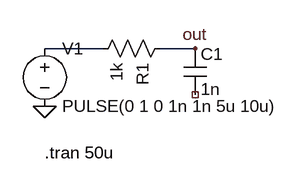
[diagram p0: schematic rc.asc]
rc.asc, the LTspice schematic file:
Version 4
SHEET 1 880 680
WIRE 112 96 32 96
WIRE 240 96 192 96
FLAG 32 176 0
FLAG 240 96 out
SYMBOL voltage 32 80 R0
SYMATTR InstName V1
SYMATTR Value PULSE(0 1 0 1n 1n 5u 10u)
SYMBOL res 208 80 R90
SYMATTR InstName R1
SYMATTR Value 1k
SYMBOL cap 224 96 R0
SYMATTR InstName C1
SYMATTR Value 1n
TEXT 32 240 Left 2 !.tran 50u

The netlist it stands for:
* rc.asc
V1 N001 0 PULSE(0 1 0 1n 1n 5u 10u)
R1 out N001 1k
C1 out NC_01 1n
.tran 50u
.backanno
.end